# Altium schematic sheet pwr.SchDoc: =ProjectName+'_'+Revision+'_'+VariantName
size A3; Date: [Sheet Date]; Author: [Sheet Author]; DocumentNumber: 2; Revision: 0; SheetNumber: 2; SheetTotal: 5
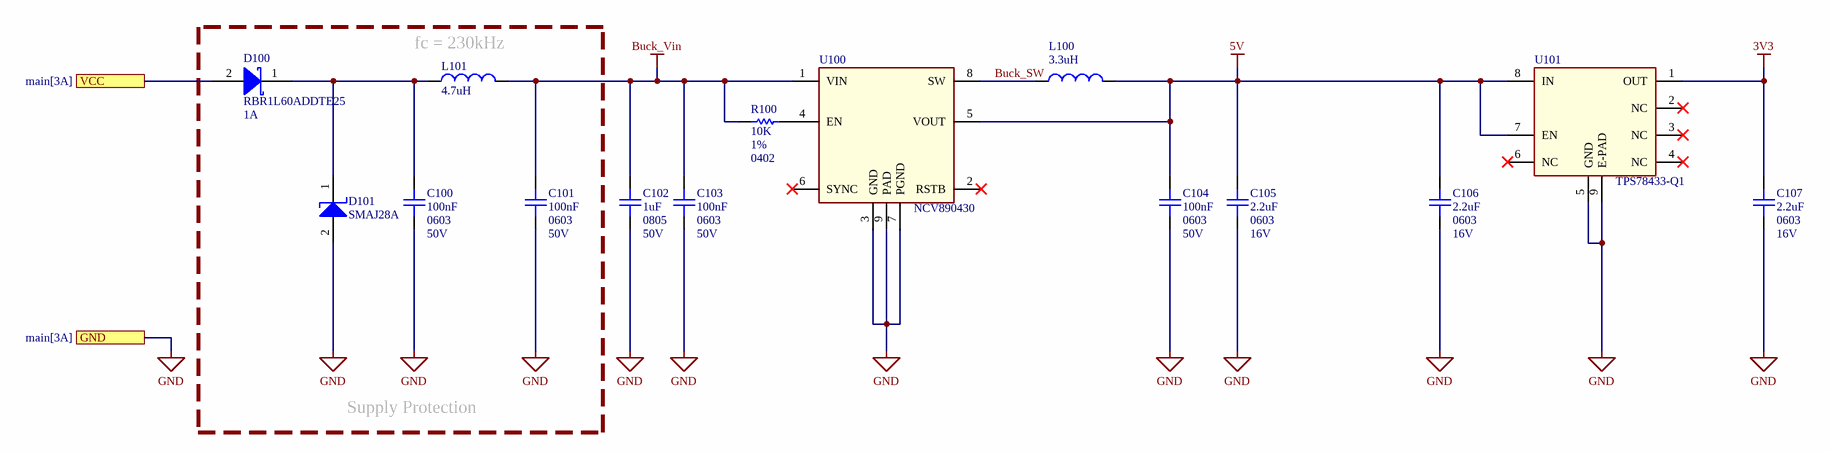
[diagram p0: pwr.SchDoc]

## Parts
C100  Case/Package: 0603  Op Voltage: 50V  [CER0603]  (hidden comment: 100nF)
C101  Case/Package: 0603  Op Voltage: 50V  [CER0603]  (hidden comment: 100nF)
C102  Case/Package: 0805  Op Voltage: 50V  [CER0805]  (hidden comment: 1uF)
C103  Case/Package: 0603  Op Voltage: 50V  [CER0603]  (hidden comment: 100nF)
C104  Case/Package: 0603  Op Voltage: 50V  [CER0603]  (hidden comment: 100nF)
C105  Case/Package: 0603  Op Voltage: 16V  [CER0603]  (hidden comment: 2.2uF)
C106  Case/Package: 0603  Op Voltage: 16V  [CER0603]  (hidden comment: 2.2uF)
C107  Case/Package: 0603  Op Voltage: 16V  [CER0603]  (hidden comment: 2.2uF)
D100  value RBR1L60ADDTE25  If (A): 1A  [DO-214AC_SMA]  (hidden comment: Shottky Rect Diode SMD)
D101  value SMAJ28A  [DO-214AC_SMA]  (hidden comment: SMD/PTH TVS Unidirectional Diode)
L100  value 3.3uH  [WE-MAPI_1212]  (hidden comment: SMD Inductor)
L101  value 4.7uH  [WE-LQ_1210]  (hidden comment: SMD Inductor)
R100  value 10K  Tolerance: 1%  Case/Package: 0402  [Res0402]  (hidden comment: SMD Resistor)
U100  value NCV890430  [SON65P300X300X100-9N]  (hidden comment: ONSEMI_NCV890430)
U101  value TPS78433-Q1  [SON65P300X100_HS-9N]  (hidden comment: TI_TPS78533Q_VSON)

## Ports
GND (see main[3A]), VCC (see main[3A])

## Nets
3V3: C107.1 U101.1(OUT)
5V: C104.1 C105.1 C106.1 L100.2 U100.5(VOUT) U101.7(EN) U101.8(IN)
Buck_Vin: C101.1 C102.1 C103.1 L101.2 R100.2 U100.1(VIN)
GND: C100.2 C101.2 C102.2 C103.2 C104.2 C105.2 C106.2 C107.2 D101.2(A) U100.3(GND) U100.7(PGND) U100.9(PAD) U101.5(GND) U101.9(E-PAD) ; port GND
Buck_SW: L100.1 U100.8(SW)
VCC: D100.2(A) ; port VCC
NetC100_1: C100.1 D100.1(K) D101.1(K) L101.1
NetR100_1: R100.1 U100.4(EN)

Not connected (* = marked no-connect by the designer): U100 2(RSTB)* 6(SYNC)*; U101 2(NC)* 3(NC)* 4(NC)* 6(NC)*

## Notes on the sheet
- (near L101) fc = 230kHz
- Supply Protection
- Proj
- Title:
- Approved:
- Sheet
- File Name:
- Rev:
- Author:
- Date:
- Size:
- A3
- Number:

## Library data of the parts
C100 C101 C103 C104 = GCM188L81H104KA57D: MLCC Automotive, 100nF, 0603, 50V, 10%, X8L; MFG1: MURATA; Min Op# Temp °C: -55; Max Op# temp °C: 150; Qualification: AEC-Q200; MPN1: GCM188L81H104KA57D; Value: 100nF; MFG2: MURATA; MPN2: GCJ188L8EL104KA07; Tolerance: 10%; Dielectric: X8L; Supplier: Mouser; Supplier Part Number: 81-GCM188L81H104KA7D; Supplier URL: https://www.mouser.it/ProductDetail/Murata-Electronics/GCM188L81H104KA57J?qs=yTuLhIm%2Fv1CdnQNNqnCjYQ%3D%3D; Datasheet URL: https://www.mouser.it/datasheet/2/281/1/GCM188L81H104KA57_01A-3144042.pdf; Termination: Soft (GCJ); Technology: Powertrain/Safety for Automotive
C102 = KAM21KR71H105KL: MLCC Automotive, 1uF, 0805, 50V, 10%, X7R; MFG1: KYOCERA-AVX; Min Op# Temp °C: -55; Max Op# temp °C: 125; Qualification: AEC-Q200; MPN1: KAM21KR71H105KL; Value: 1uF; Tolerance: 10%; Dielectric: X7R; Supplier: Mouser; Supplier Part Number: 581-KAM21KR71H105KL; Supplier URL: https://www.mouser.it/ProductDetail/KYOCERA-AVX/08055C105K4T4A?qs=byeeYqUIh0Oh891bMlItEA%3D%3D; Datasheet URL: https://www.mouser.it/datasheet/2/40/AutoMLCC-2952695.pdf; Technology: Powertrain/Safety for Automotive
C105-C107 = GRT188C71C225KE13D: MLCC Automotive, 2.2uF, 0603, 16V, 10%, X7S; MFG1: MURATA; Min Op# Temp °C: -55; Max Op# temp °C: 125; Qualification: AEC-Q200; MPN1: GRT188C71C225KE13D; Value: 2.2uF; Tolerance: 10%; Dielectric: X7S; Supplier: Mouser; Supplier Part Number: 81-GRT188C71C225KE3D; Supplier URL: https://www.mouser.it/it/ProductDetail/Murata-Electronics/GRT188C71C225KE13D?qs=hd1VzrDQEGhlNcWcmqnE6Q%3D%3D; Datasheet URL: https://www.mouser.it/datasheet/3/76/1/GRT188C71C225KE13_01A.pdf
D100 = RBR1L60ADDTE25: Schottky Rectifier Diode 1A 60V SMA; MFG1: ROHM; Min Op# Temp °C: -55; Max Op# temp °C: 150; Qualification: AEC-Q101; MPN1: RBR1L60ADDTE25; Vreverse: 60V; Case/Package: SMA(DO-214AC); Supplier: Mouser; Supplier Part Number: 755-RBR1L60ADDTE25; Supplier URL: https://www.mouser.it/it/ProductDetail/ROHM-Semiconductor/RBR1L60ADDTE25?qs=4v%252BiZTmLVHHPf04ac7QKmA%3D%3D; Datasheet URL: https://www.rohm.com/datasheet?p=RBR1L60ADD&dist=Mouser&media=referral&source=mouser.com&campaign=Mouser
D101 = SMAJ28A-13-F: TVS Unidir 28V SMA; MPN1: SMAJ28A-13-F
L100 = 74438333033: Power Inductors - SMD WE-MAPI 3,3uH 1.1A DCR=266mOhms AECQ200; MFG1: WE; Fres (MHz): 38; Rated Current (mA): 1.85; Sat Current (mA): 2.05; Rated Voltage: 80; Min Op# Temp °C: -40; Max Op# temp °C: 125; Qualification: AEC-Q200; MPN1: 74438333033; DCR (mR): 266mOhm; Case/Package: 1212; Supplier: Mouser; Supplier Part Number: 710-74438333033; Supplier URL: https://www.mouser.it/it/ProductDetail/Wurth-Elektronik/74438333033?qs=ZB8tH5z5N7YH5nN%252BUBdrEg%3D%3D; Datasheet URL: https://www.we-online.com/components/products/datasheet/74438333033.pdf; Technology: SMD
L101 = 744032004: EMI Filtering Inductor WE-LQ SMT, 4.7uH, 490mA,; MFG1: WE; Rated Current (mA): 490; Sat Current (mA): 1250; DCR (mR): 280mOhm; Min Op# Temp °C: -40; Max Op# temp °C: 125; MPN1: 744032004; Case/Package: 1210; Supplier: Mouser; Supplier Part Number: 710-744032004; Supplier URL: https://www.mouser.it/it/ProductDetail/Wurth-Elektronik/744032004?qs=XJfXErqHgA4qekdNbV2MtQ%3D%3D; Datasheet URL: https://www.we-online.com/components/products/datasheet/744032004.pdf; Technology: SMD
R100 = CRCW040210K0FKED: Thick Film SM Chip Resistors, 10K, 0402, ±1%, 1/10W; MFG1: VISHAY; Power: 63mW; Temp# Coeffiient (PPM/C): 100; Min Op# Temp °C: -55; Max Op# temp °C: 155; Qualification: AEC-Q200; MPN1: CRCW040210K0FKED; Supplier: Mouser; Supplier Part Number: 71-CRCW0402-10K-E3; Supplier URL: https://www.mouser.it/ProductDetail/Vishay-Dale/CRCW040210K0FKED?qs=rlE3Te1NifyN3e8vvxacSw%3D%3D; Technology: Thick Film
U100 = NCV890430MW50TXG: synchronous buck converter; 3.5-37Vin; 5Vout; 600mA; MFG1: OnSemi; Frequency: 2MHz / 1MHz; Max Duty Cycle: 1; Max Input Voltage: 37V; Min Supply Voltage: 3.5V; Min Op# Temp °C: -40°C; Max Op# temp °C: 150°C; Nominal Output Voltage: 5V; Qualification: AEC-Q100; MPN1: NCV890430MW50TXG; Case/Package: DFN-8; Op Voltage: 3.5-37V; Supplier: Mouser; Supplier Part Number: 863-NCV890430MW50TXG; Supplier URL: https://www.mouser.it/it/ProductDetail/onsemi/NCV890430MW50TXG?qs=OycAS1CGnlh8h8gdwAjytg%3D%3D; Datasheet URL: https://www.onsemi.com/download/data-sheet/pdf/ncv890430-d.pdf; ComponentType: DCDC converter; Max Ouput Current: 600mA; Max Supply Voltage (DC): 37V; Min Input Voltage: 3.5V; Switching Frequency: 2MHz / 1MHz
U101 = TPS78433QWDRBRQ1: TPS784-Q1 Automotive, 3.3V, 300mA, High-PSRR LDO; MFG1: TI; Vin Min (V): 1.7; Vin Max (V): 6V; Out Voltage Accuracy: 0.5%; Dropout @ Imax (V): 0.08; Quiescent cuttent(uA): 25; Min Op# Temp °C: -40; Max Op# temp °C: 150; Qualification: AEC-Q100; MPN1: TPS78433QWDRBRQ1; Case/Package: WSON-8 3x3; Imax (mA): 300mA; Output Type: 3.3V; Supplier: Mouser; Supplier Part Number: 595-TPS78433QWDRBRQ1; Supplier URL: https://www.mouser.it/ProductDetail/Texas-Instruments/TPS78433QWDRBRQ1?qs=iLbezkQI%252BsgJRXPFYNHjvQ%3D%3D; Datasheet URL: https://www.ti.com/lit/gpn/tps784-q1